# Altium schematic sheet RTC.SchDoc: RTC y EEPROM
size A4; Author: Agustin Zuliani; Revision: 00; SheetNumber: 7; SheetTotal: 7
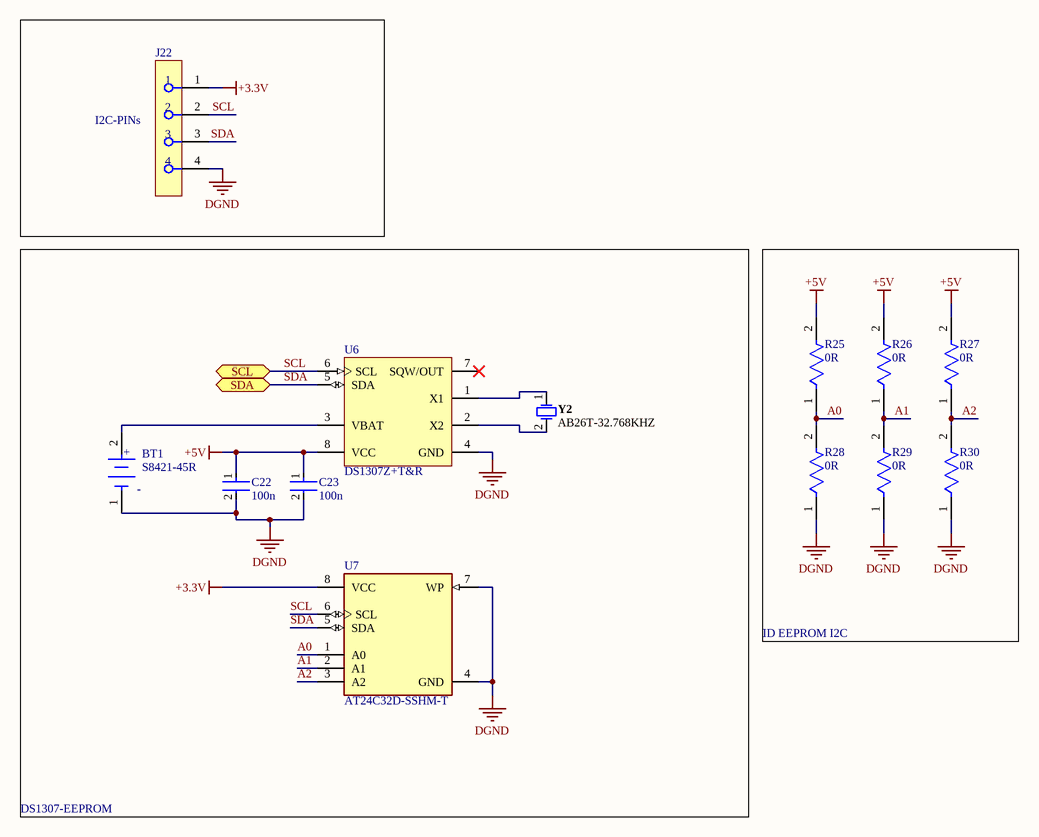
[diagram p0: RTC.SchDoc]

## Parts
BT1  S8421-45R  [FP-S8421-45R-MFG]
C22  100n  [FP-C0805C-DN-MFG]
C23  100n  [FP-C0805C-DN-MFG]
J22  I2C-PINs  [FP-ESW-104-23-G-S-MFG]
R25  0R  [FP-TLRZ1E-MFG]
R26  0R  [FP-TLRZ1E-MFG]
R27  0R  [FP-TLRZ1E-MFG]
R28  0R  [FP-TLRZ1E-MFG]
R29  0R  [FP-TLRZ1E-MFG]
R30  0R  [FP-TLRZ1E-MFG]
U6  DS1307Z+T&R  [S8+2_L]
U7  AT24C32D-SSHM-T  [FP-C04-057-SN-IPC_C]
Y2  AB26T-32.768KHZ  [ABRA-AB26T]

## Blocks framed on the sheet
DS1307-EEPROM: BT1 C22 C23 U6 U7 Y2
ID EEPROM I2C: R25-R30

## Ports
SCL (bidir), SDA (bidir)

## Nets
+3.3V: J22.1 U7.8(VCC)
+5V: C22.1 C23.1 R25.2 R26.2 R27.2 U6.8(VCC)
DGND: BT1.1(C) C22.2 C23.2 J22.4 R28.1 R29.1 R30.1 U6.4(GND) U7.4(GND) U7.7(WP)
A0: R25.1 R28.2 U7.1(A0)
A1: R26.1 R29.2 U7.2(A1)
A2: R27.1 R30.2 U7.3(A2)
SCL: J22.2 U6.6(SCL) U7.6(SCL) ; port SCL
SDA: J22.3 U6.5(SDA) U7.5(SDA) ; port SDA
NetBT1_2: BT1.2(A) U6.3(VBAT)
NetU6_1: U6.1(X1) Y2.1
NetU6_2: U6.2(X2) Y2.2

Not connected (* = marked no-connect by the designer): U6 7(SQW/OUT)*

## Notes on the sheet
- (in symbol CMP-2000-07028-3) +; -

## Library data of the parts
BT1 = CMP-2000-07028-3: BATTERY HOLDER COIN 20MM SMD; Number of Cells: 1; Min Operating Temperature: -40°C; Packaging: Tape and Reel; Max Operating Temperature: 105°C; Number of Batteries: 1; Package Quantity: 500; Material: Polyphenylene; Case/Package: SMD/SMT; Mount: Surface Mount; REACH SVHC: No SVHC; Contact Plating: Bronze; Termination: SMD/SMT
C22 C23 = CMP-2007-00520-2: CAP 100nf 20% 0805; Manufacturer: KEMET; Manufacturer Part Number: C0805C101J1GAC7210; Value: 100 pF; Temperature Characteristic: C0G; Material: Ceramic; Tolerance: 0.05; Voltage Rating: 100 V; Temperature Coefficient: 30ppm/°C; Package: C0805C-DN; Device Class L1: Passive Components; Octopart: https://octopart.com/c0805c101j1gac7210-kemet-9145156; RoHS: TRUE; Capacitance: 100 pF; Ipc Land Pattern Name: CAPC200125X78; Temperature Range Low: -55°C; Temperature Range High: +125°C; ComponentLink2Description: Datasheet; Lead Free: Yes; Temperature: -55°C to +125°C; ComponentLink2URL: https://content.kemet.com/datasheets/KEM_C1003_C0G_SMD.pdf; Category: Cap; Device Class L2: Capacitors; Mouser Description: Multilayer Ceramic Capacitors MLCC - SMD/SMT 100volts 100pF C0G 5%; Height: 0.88mm; Automotive: No; Device Class L3: Ceramic Capacitors
J22 = CMP-00575-09268283-1: HEADER PINS 4 POS / I2C Pins; Manufacturer Lifecycle Status: PRODUCTION; Contact Resistance: 10mΩ; Max Voltage Rating (AC): 550V; Current Rating: 5.2A; Max Current Rating: 6.9A; Number of Contacts: 4; Pitch: 2.54mm; Length: 10.67mm; Termination: Solder; Contact Material: Gold, Nickel; Orientation: Straight; Housing Material: Polyester; Max Operating Temperature: 125°C; Depth: 2.41mm; RoHS: Compliant; Housing Color: Black; Min Operating Temperature: -55°C; Number of Rows: 1; Height: 13.72mm; Radiation Hardening: No; Lifecycle Status: Production; Contact Plating: Gold
R25-R30 = CMP-00683-81738753-1: RES 0R 5% 0805; Resistance: 0Ω; NexarPartId: 81738753; Min Operating Temperature: -65°C; Height: 405µm; Max Operating Temperature: 170°C; Composition: Metal Element; Case/Package: 0402; Lifecycle Status: Production
U6 = CMP-0254-00305-1: CI DS1307; Code_JEDEC: MS-012-AA; Code_IPC: SOIC127P600-8; ComponentLink2Description: Datasheet; DatasheetVersion: 10-Feb-2008; ComponentLink2URL: http://datasheets.maxim-ic.com/en/ds/DS1307.pdf; PackageVersion: revC, 2010; ComponentLink1Description: Manufacturer URL; PackageDescription: 8-Pin Small-Outline IC, Narrow (0.15in), 1.27 mm Pitch, SOIC (N), Pb-Free; ComponentLink1URL: http://www.maxim-ic.com; ComponentLink3URL: http://pdfserv.maxim-ic.com/package_dwgs/21-0041.PDF; PackageReference: S8+2; ComponentLink3Description: Package Specification
U7 = CMP-06313-000048-1: CI EEPROM 32K I2C 1MHZ 8SOIC; Memory Type: Non-Volatile; Memory Size: 32Kb; Access Time: 550ns; Frequency: 1MHz; Max Operating Temperature: 85°C; Number of Pins: 8; Packaging: Tape and Reel; Min Operating Temperature: -40°C; Case/Package: SOIC; Mount: Surface Mount
Y2 = CMP-2000-05723-1: CRYSTAL 32.768KHz RTC; Manufacturer: ABRACON; ESR: 35kOhms; Frequency Stability: -0.034PPM; Load Capacitance: 12.5pF; Tolerance: 20PPM; Case Length: 6.2mm; Case Diameter: 2.1mm; RoHS: Details; Product Category: Crystals; Type: WatchCrystal; Manufacturer URL: http://www.abracon.com/; Operating Temperature Range: -10Cto+60C; Package Description: 2-Pin Through Hole Device, Dia 2.1 mm, Body Length 6.2 mm; Termination Style: Radial; Datasheet Version: 06/2010; Datasheet URL: http://www.abracon.com/Resonators/AB26T.pdf; Packaging: Bulk; Factory Pack Quantity: 500; Brand: ABRACON; Mounting Technology: ThroughHole; Package URL: http://www.abracon.com/Support/PackageDrawing/Resonators/AB26T.PDF; Package / Case: Cylinder; Lead Spacing: 0.8mm; Dimensions: 2.1mmDia.x6.2mmL; Mounting Style: ThroughHole; Frequency: 32.768kHz; Package Reference: AB26T; Series: AB26T